# Altium schematic sheet CANmon.SchDoc: CANmon CAN BUS Monitor
size Letter; Date: 2015-11-21; Revision: 2; PageSetup: Record=PageOptions|CenterHorizontal=True|CenterVertical=True|PrintScale=0.98|XCorrection=1.00|YCorrection=1.00|PrintKind=1|BorderSize=5000000|LeftOffset=0|BottomOffset=0|Orientation=2|PaperLength=1000|PaperWidth=1000|Scale=100|PaperSource=7|PrintQuality=-3|MediaType=1|DitherType=10|PrintScaleMode=1|PaperKind=Letter|PaperIndex=1
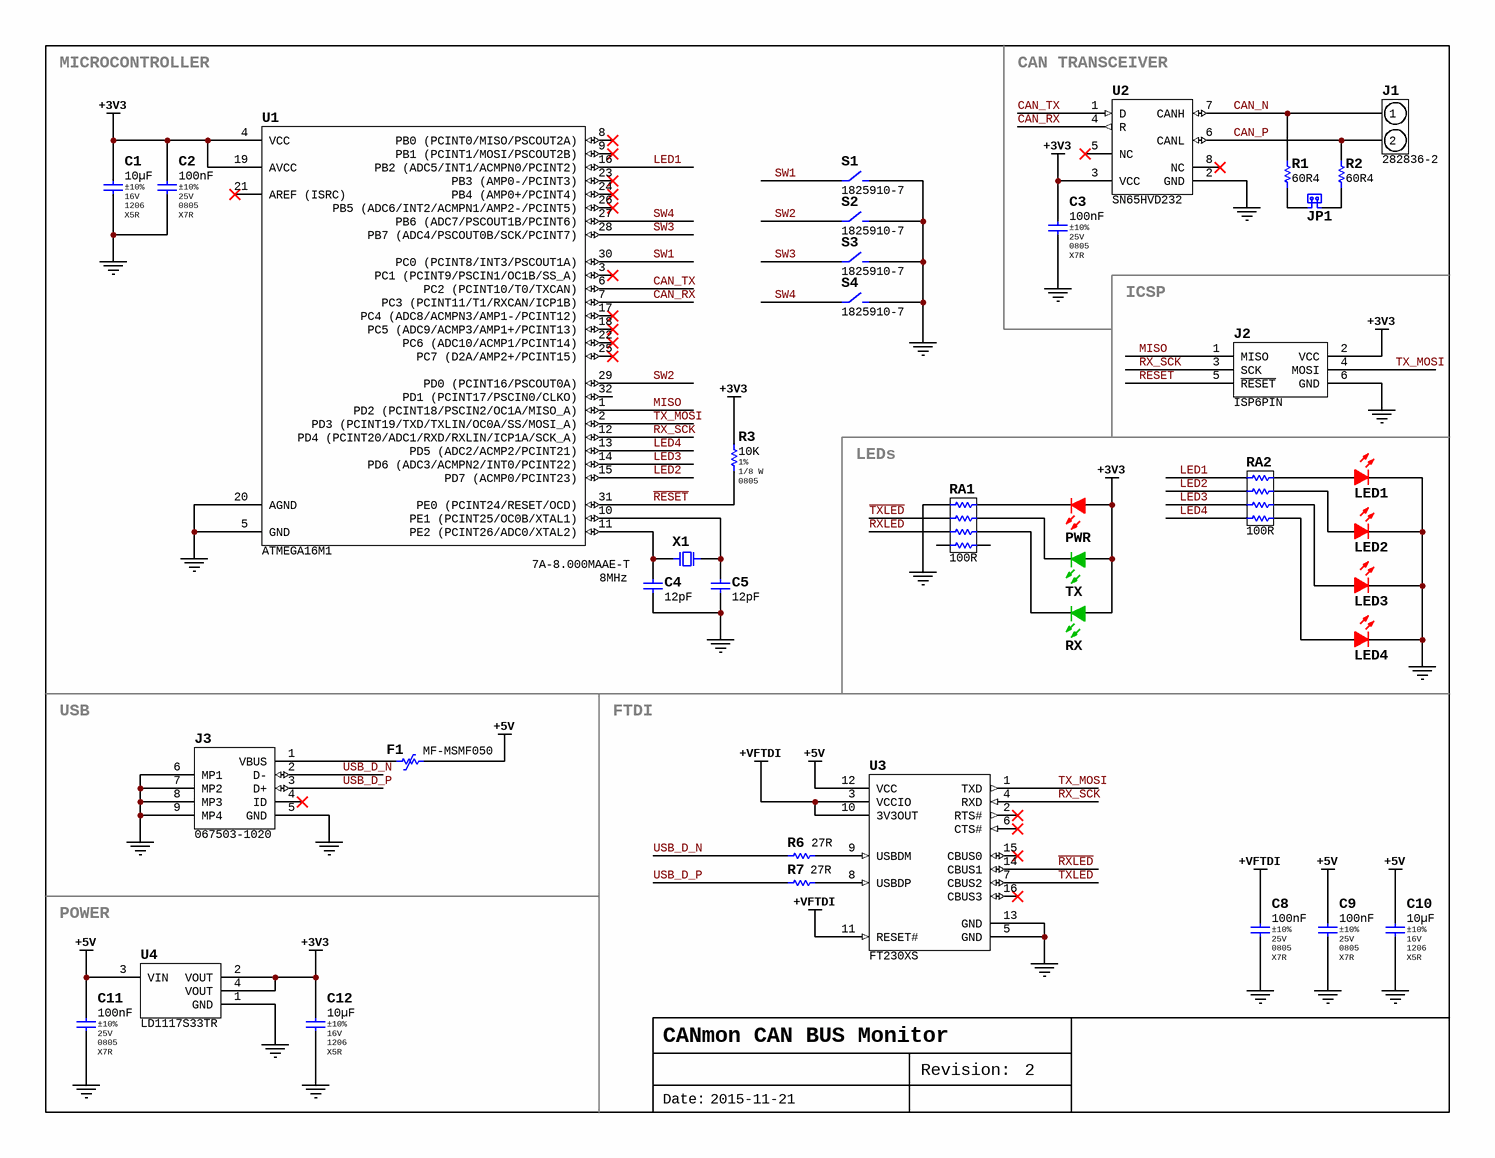
[diagram p0: CANmon.SchDoc]

## Parts
C1  10µF  Tolerance: ±10%  Voltage: 16V  Package: 1206  Temperature Coefficient: X5R  [CAP-1206-M]
C2  100nF  Tolerance: ±10%  Voltage: 25V  Package: 0805  Temperature Coefficient: X7R  [CAP-0805-M]
C3  100nF  Tolerance: ±10%  Voltage: 25V  Package: 0805  Temperature Coefficient: X7R  [CAP-0805-M]
C4  value 12pF  [CAP-0603-M]  (hidden comment: CC0603JRNPO9BN120)
C5  value 12pF  [CAP-0603-M]  (hidden comment: CC0603JRNPO9BN120)
C8  100nF  Tolerance: ±10%  Voltage: 25V  Package: 0805  Temperature Coefficient: X7R  [CAP-0805-M]
C9  100nF  Tolerance: ±10%  Voltage: 25V  Package: 0805  Temperature Coefficient: X7R  [CAP-0805-M]
C10  10µF  Tolerance: ±10%  Voltage: 16V  Package: 1206  Temperature Coefficient: X5R  [CAP-1206-M]
C11  100nF  Tolerance: ±10%  Voltage: 25V  Package: 0805  Temperature Coefficient: X7R  [CAP-0805-M]
C12  10µF  Tolerance: ±10%  Voltage: 16V  Package: 1206  Temperature Coefficient: X5R  [CAP-1206-M]
F1  MF-MSMF050  [MF-MSMF050]
J1  282836-2  [282836-2]
J2  ISP6PIN  [ISP6PIN]
J3  067503-1020  [MOLX-67503-1020_V]
JP1  M20-9990246  [M20-9990246]  (value not drawn)
LED1  LS R976-NR-1  [LED-0805-RED]  (value not drawn)
LED2  LS R976-NR-1  [LED-0805-RED]  (value not drawn)
LED3  LS R976-NR-1  [LED-0805-RED]  (value not drawn)
LED4  LS R976-NR-1  [LED-0805-RED]  (value not drawn)
PWR  LS R976-NR-1  [LED-0805-RED]  (value not drawn)
R1  value 60R4  [RES-1206-M]  (hidden comment: RC3216F60R4CS)
R2  value 60R4  [RES-1206-M]  (hidden comment: RC3216F60R4CS)
R3  10K  Tolerance: 1%  Power: 1/8 W  Package: 0805  [RES-0805-M]
R6  value 27R  [RES-0603-M]  (hidden comment: RC0603FR-0727RL)
R7  value 27R  [RES-0603-M]  (hidden comment: RC0603FR-0727RL)
RA1  100R  [CAC-127P519X309-8M]
RA2  100R  [CAC-127P519X309-8M]
RX  LG R971-KN-1  [LED-0805-GRN]  (value not drawn)
S1  1825910-7  [1825910-7]
S2  1825910-7  [1825910-7]
S3  1825910-7  [1825910-7]
S4  1825910-7  [1825910-7]
TX  LG R971-KN-1  [LED-0805-GRN]  (value not drawn)
U1  ATMEGA16M1  [32-TQFP-7x7-0.8]
U2  SN65HVD232  [8-SOIC]
U3  FT230XS  [16-SSOP-0.635mm]
U4  LD1117S33TR  [SOT-223_N]
X1  7A-8.000MAAE-T  value 8MHz  [TXC 7A]

## Nets
+3V3: C1.2 C2.2 C3.2 C12.2 J2.2(VCC) PWR.1(A) R3.2 RX.1(A) TX.1(A) U1.4(VCC) U1.19(AVCC) U2.3(VCC) U4.2(VOUT) U4.4(VOUT)
+5V: C9.2 C10.2 C11.2 F1.2 U3.12(VCC) U4.3(VIN)
+VFTDI: C8.2 U3.3(VCCIO) U3.10(3V3OUT) U3.11(RESET#)
GND: C1.1 C2.1 C3.1 C4.2 C5.2 C8.1 C9.1 C10.1 C11.1 C12.1 J2.6(GND) J3.5(GND) J3.6(MP1) J3.7(MP2) J3.8(MP3) J3.9(MP4) LED1.2(K) LED2.2(K) LED3.2(K) LED4.2(K) RA1.1 S1.3,4 S2.3,4 S3.3,4 S4.3,4 U1.5(GND) U1.20(AGND) U2.2(GND) U3.5(GND) U3.13(GND) U4.1(GND)
CAN_N: J1.1 R1.1 U2.7(CANH)
CAN_P: J1.2 R2.1 U2.6(CANL)
CAN_RX: U1.7(PC3_(PCINT11/T1/RXCAN/ICP1B)) U2.4(R)
CAN_TX: U1.6(PC2_(PCINT10/T0/TXCAN)) U2.1(D)
LED1: RA2.1 U1.16(PB2_(ADC5/INT1/ACMPN0/PCINT2))
LED2: RA2.2 U1.15(PD7_(ACMP0/PCINT23))
LED3: RA2.3 U1.14(PD6_(ADC3/ACMPN2/INT0/PCINT22))
LED4: RA2.4 U1.13(PD5_(ADC2/ACMP2/PCINT21))
MISO: J2.1(MISO) U1.1(PD2_(PCINT18/PSCIN2/OC1A/MISO_A))
~{RESET}: J2.5(~{RESET}) R3.1 U1.31(PE0_(PCINT24/RESET/OCD))
~{RXLED}: RA1.3 U3.14(CBUS1)
RX_SCK: J2.3(SCK) U1.12(PD4_(PCINT20/ADC1/RXD/RXLIN/ICP1A/SCK_A)) U3.4(RXD)
SW1: S1.1,2 U1.30(PC0_(PCINT8/INT3/PSCOUT1A))
SW2: S2.1,2 U1.29(PD0_(PCINT16/PSCOUT0A))
SW3: S3.1,2 U1.28(PB7_(ADC4/PSCOUT0B/SCK/PCINT7))
SW4: S4.1,2 U1.27(PB6_(ADC7/PSCOUT1B/PCINT6))
~{TXLED}: RA1.2 U3.7(CBUS2)
TX_MOSI: J2.4(MOSI) U1.2(PD3_(PCINT19/TXD/TXLIN/OC0A/SS/MOSI_A)) U3.1(TXD)
USB_D_N: J3.2(D-) R6.1
USB_D_P: J3.3(D+) R7.1
NetC4_1: C4.1 U1.11(PE2_(PCINT26/ADC0/XTAL2)) X1.1
NetC5_1: C5.1 U1.10(PE1_(PCINT25/OC0B/XTAL1)) X1.2
NetF1_1: F1.1 J3.1(VBUS)
NetJP1_1: JP1.1 R1.2
NetJP1_2: JP1.2 R2.2
NetLED1_1: LED1.1(A) RA2.8
NetLED2_1: LED2.1(A) RA2.7
NetLED3_1: LED3.1(A) RA2.6
NetLED4_1: LED4.1(A) RA2.5
NetPWR_2: PWR.2(K) RA1.8
NetR6_2: R6.2 U3.9(USBDM)
NetR7_2: R7.2 U3.8(USBDP)
NetRA1_6: RA1.6 RX.2(K)
NetRA1_7: RA1.7 TX.2(K)

Not connected (* = marked no-connect by the designer): J3 4(ID)*; RA1 4 5; U1 3(PC1_(PCINT9/PSCIN1/OC1B/SS_A))* 8(PB0_(PCINT0/MISO/PSCOUT2A))* 9(PB1_(PCINT1/MOSI/PSCOUT2B))* 17(PC4_(ADC8/ACMPN3/AMP1-/PCINT12))* 18(PC5_(ADC9/ACMP3/AMP1+/PCINT13))* 21(AREF_(ISRC))* 22(PC6_(ADC10/ACMP1/PCINT14))* 23(PB3_(AMP0-/PCINT3))* 24(PB4_(AMP0+/PCINT4))* 25(PC7_(D2A/AMP2+/PCINT15))* 26(PB5_(ADC6/INT2/ACMPN1/AMP2-/PCINT5))* 32(PD1_(PCINT17/PSCIN0/CLKO)); U2 5(NC)* 8(NC)*; U3 2(RTS#)* 6(CTS#)* 15(CBUS0)* 16(CBUS3)*

## Notes on the sheet
- MICROCONTROLLER
- (near U2) CAN TRANSCEIVER
- ICSP
- LEDs
- USB
- FTDI
- POWER
- Date:
- Revision:

## Library data of the parts
C1 C10 C12 = CC1206KKX5R7BB106: Manufacturer: Yageo; Manufacturer Series: CC; Part Number: CC1206KKX5R7BB106; Component Type: Standard; Value: 10µF; Temperature Range: -55°C ~ 85°C; Supplier 1: Digi-Key; Supplier Part Number 1: 311-1465-1-ND
C2 C3 C8 C9 C11 = CC0805KRX7R8BB104: Manufacturer: Yageo; Manufacturer Series: CC; Part Number: CC0805KRX7R8BB104; Component Type: Standard; Value: 100nF; Temperature Range: -55°C ~ 125°C; Supplier 1: Digi-Key; Supplier Part Number 1: 311-1141-1-ND
C4 C5 = CC0603JRNPO9BN120: CAP 12pF 5% 50V C0G,NP0 0603; Package: 0603; Tolerance: 5%; Voltage: 50V; Dielectric: C0G,NP0; Supplier 1: Digi-Key; Supplier Part Number 1: 311-1059-1-ND
F1 = MF-MSMF050: PTC Resettable Fuse 0.50A; Supplier 1: Digi-Key; Supplier Part Number 1: MF-MSMF050-2CT-ND
J1 = 282836-2: Terminal Block 2-pos Side Entry 5mm; Supplier 1: Digi-Key; Supplier Part Number 1: A98076-ND
J2 = ISP6PIN: AVR ISP 2.54mm Header 2x3-Pin; Supplier 1: Digi-Key; Supplier Part Number 1: 952-2121-ND
J3 = 067503-1020: USB Mini-B; Supplier 1: Digi-Key; Supplier Part Number 1: WM5461CT-ND
JP1 = JUMPER-1: 2.54mm Header Jumper; Supplier 1: Digi-Key; Supplier Part Number 1: 952-2262-ND
LED1-LED4 PWR = LS R976-NR-1: CHIPLED 0805 Red; Supplier 1: Digi-Key; Supplier Part Number 1: 475-1278-1-ND
R1 R2 = RC3216F60R4CS: RES 60R4 1% 0.25W 1206; Supplier 1: Digi-Key; Supplier Part Number 1: 1276-5663-1-ND
R3 = RC0805FR-0710KL: Manufacturer: Yageo; Manufacturer Series: RC; Temperature Coefficient: ±100ppm/°C; Part Number: RC0805FR-0710KL; Component Type: Standard; Value: 10K; Temperature Range: -55°C ~ 155°C; Supplier 1: Digi-Key; Supplier Part Number 1: 311-10.0KCRCT-ND
R6 R7 = RC0603FR-0727RL: RES 0.1W 27R 1% 0603; Supplier 1: Digi-Key; Supplier Part Number 1: 311-27.0HRCT-ND
RA1 RA2 = MNR34J5ABJ101
RX TX = LG R971-KN-1: CHIPLED 0805 Green; Supplier 1: Digi-Key; Supplier Part Number 1: 475-1410-1-ND
U1 = ATMEGA16M1: ATmega16M1 microcontroller; Supplier 1: Digi-Key; Supplier Part Number 1: ATMEGA16M1-AU-ND
U2 = SN65HVD232: CAN transceiver; Supplier 1: Digi-Key; Supplier Part Number 1: 296-26344-1-ND
U3 = FT230XS: USB-RS232 Bridge 16-SSOP; Supplier 1: Digi-Key; Supplier Part Number 1: 768-1135-1-ND
U4 = LD1117S33TR: LDO 3.3V 0.8A SOT223; Supplier 1: Digi-Key; Supplier Part Number 1: 497-1242-1-ND
X1 = 7A-8.000MAAE-T: SMD Crystal Oscillator 12 pF; Load Capacitance: 12pF; Supplier 1: Digi-Key; Supplier Part Number 1: 887-1740-1-ND